# EAGLE design FanControl (EAGLE 7.1.0)
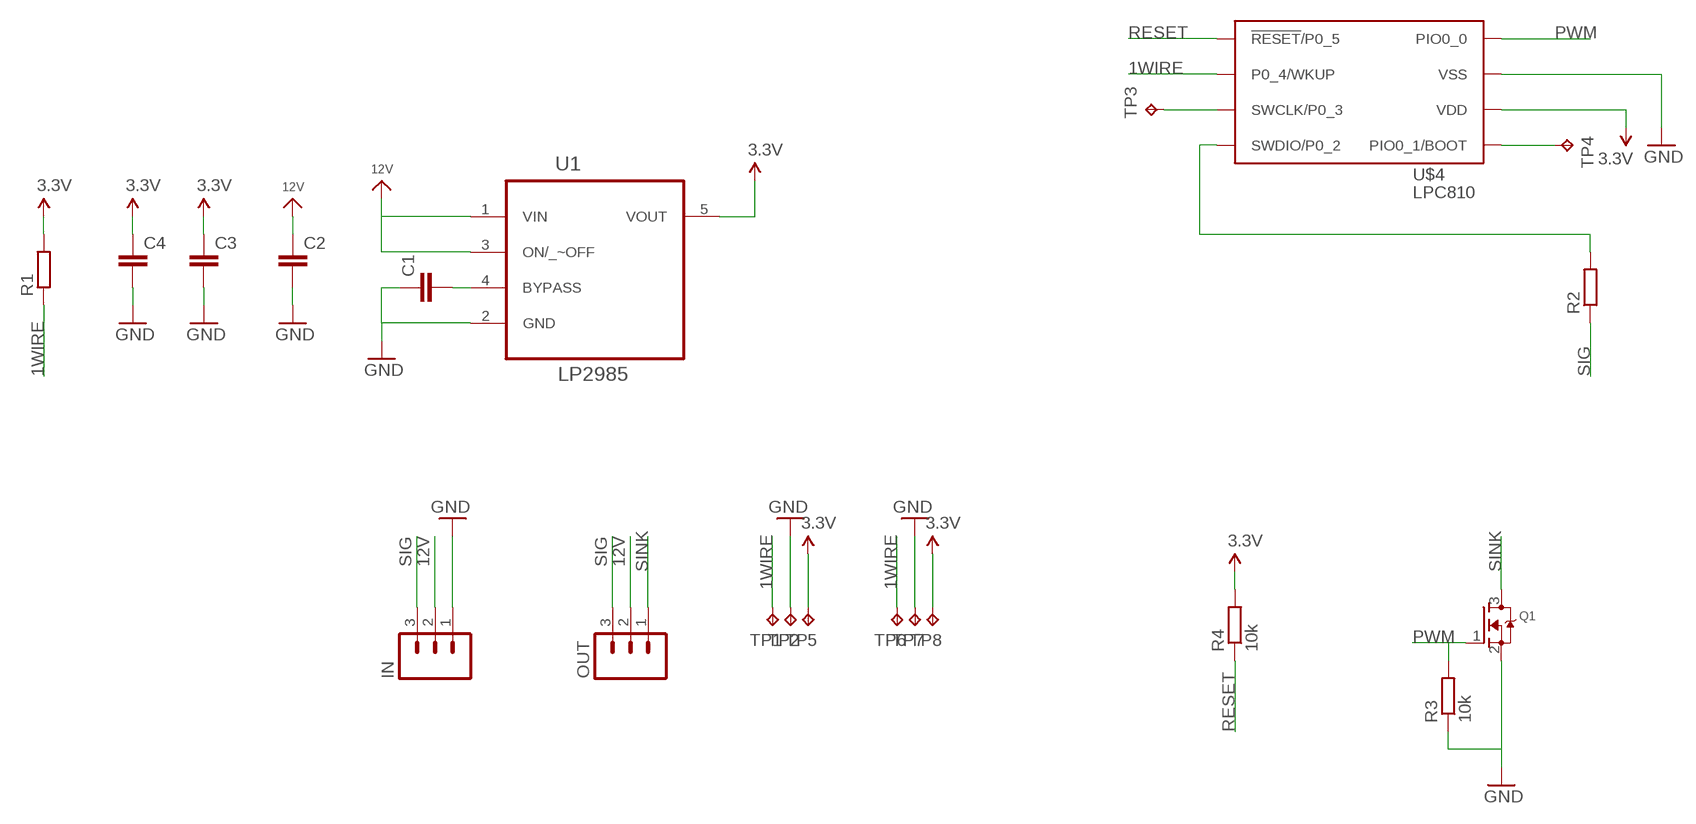
[diagram p0: schematic, sheet 1]

## Parts
C1  C-EUC0603  [C0603]
C2  C-EUC0805  [C0805]
C3  C-EUC0603  [C0603]
C4  C-EUC0805  [C0805]
IN  M03PTH  [1X03]
OUT  M03PTH  [1X03]
Q1  MOSFET-NREFLOW  [SOT23]
R1  R-EU_R0603  [R0603]
R2  R-EU_R0603  [R0603]
R3  10k  R-EU_R0603  [R0603]
R4  10k  R-EU_R0603  [R0603]
TP1  TPB1,27  [B1,27]
TP2  TPB1,27  [B1,27]
TP3  TPB1,27  [B1,27]
TP4  TPB1,27  [B1,27]
TP5  TPB1,27  [B1,27]
TP6  TPB1,27  [B1,27]
TP7  TPB1,27  [B1,27]
TP8  TPB1,27  [B1,27]
U1  LP2985  LP2985-33DBVT  [SOT95P280X145-5N]
U$4  LPC810  LPC810M021FN8  [DIP8]

## Nets
1WIRE: R1.1 TP1.TP TP6.TP U$4.P$2(P0_4/WKUP)
3.3V: C3.1 C4.1 R1.2 R4.2 TP5.TP TP8.TP U1.5(VOUT) U$4.P$6(VDD)
12V: C2.1 IN.2 OUT.2 U1.1(VIN) U1.3(ON/_~OFF)
GND: C1.1 C2.2 C3.2 C4.2 IN.1 Q1.2(S) R3.1 TP2.TP TP7.TP U1.2(GND) U$4.P$7(VSS)
N$1: C1.2 U1.4(BYPASS)
N$2: R2.2 U$4.P$4(SWDIO/P0_2)
N$3: TP3.TP U$4.P$3(SWCLK/P0_3)
N$4: TP4.TP U$4.P$5(PIO0_1/BOOT)
PWM: Q1.1(G) R3.2 U$4.P$8(PIO0_0)
RESET: R4.1 U$4.P$1(!RESET!/P0_5)
SIG: IN.3 OUT.3 R2.1
SINK: OUT.1 Q1.3(D)

## Library data of the parts
C1-C4 = rcl:C-EU: CAPACITOR, European symbol
IN OUT = SparkFun-Connectors:M03: Header 3 Standard 3-pin 0.1" header. Use with straight break away headers (SKU : PRT-00116), right angle break away headers (PRT-00553), swiss pins (PRT-00743), machine pins (PRT-00117), and female headers (PRT-00115). Molex polarized connector foot print use with SKU : PRT-08232 with associated crimp pins and housings.
Q1 = adafruit:MOSFET-N: N-Channel Mosfet 2N7002E - 60V 260mA SOT23 [Digikey: 2N7002ET1GOSTR-ND] - REEL BSH103 - 30V 850mA SOT23 [Digikey: 568-5013-1-ND]
R1-R4 = rcl:R-EU_: RESISTOR, European symbol
TP1-TP8 = testpad:TP: Test pad
U1 = farnell:LP2985-33DBVT: 150-mA LOW-NOISE LOW-DROPOUT REGULATOR WITH SHUTDOWN; MPN: LP2985-33DBVT; OC_FARNELL: -; OC_NEWARK: 43J9347; PACKAGE: SOT-23-5; SUPPLIER: Texas Instruments
U$4 = carrilib:LPC810

## Board
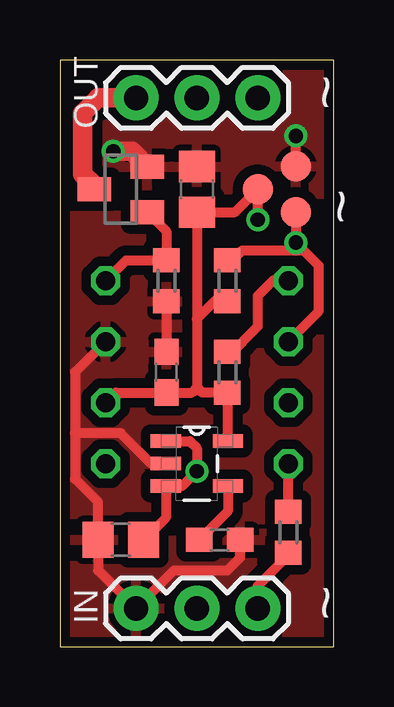
[diagram p1: board, top side]
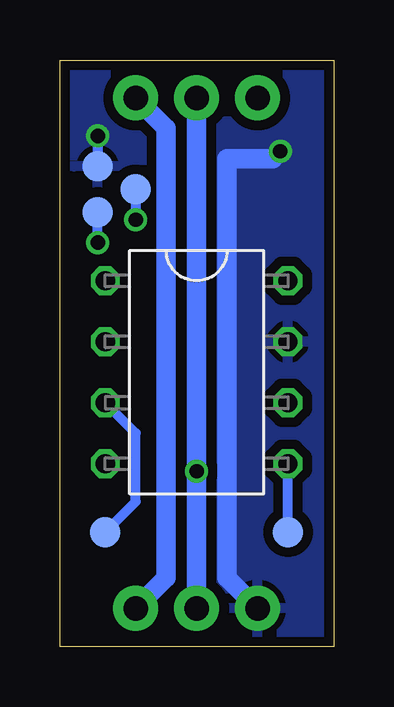
[diagram p2: board, bottom side, seen from below]

Size 11.42 x 24.44 mm. Coordinates in mm from the lower left corner, seen from the top.
Outline: 0,0 11.42,0 11.42,24.44 0,24.44 0,0
Copper layers (1*16): Top 0.0356mm / dielectric 1.5011mm / Bottom 0.0356mm
Design rules "LaenPCBOrder": minimum track width 6mil, minimum drill 13mil, track to track 6mil, track to pad 6mil, pad to pad 6mil, via to via 6mil, smd to smd 6mil, copper to edge 15mil, drill to drill 6mil, minimum pad ring 7mil, minimum via ring 7mil, stop-mask expansion 4mil, vias tented up to drill 0mil, thermal gap 10mil

### Footprints (pad centres in the part's own frame; a part is rotated, then mirrored left to right if it is on the bottom)
C0603 = smd 1.1 x 1: 1 -0.85,0; 2 0.85,0
C0805 = smd 1.3 x 1.5: 1 -0.95,0; 2 0.95,0
1X03 = drill 1.016 pad 1.88: 1 0,0; 2 2.54,0; 3 5.08,0
SOT23 = smd 1 x 1.4: 1 -0.95,-1.1; 2 0.95,-1.1; 3 0,1.1
R0603 = smd 1 x 1.1: 1 -0.85,0; 2 0.85,0
B1,27 = smd 1.27 x 1.27: TP 0,0
SOT95P280X145-5N = smd 1.27 x 0.559: 1 -1.295,0.94; 2 -1.295,0; 3 -1.295,-0.94; 4 1.295,-0.94; 5 1.295,0.94
DIP8 = drill 0.8 octagon: P$1 -3.81,3.81; P$2 -3.81,1.27; P$3 -3.81,-1.27; P$4 -3.81,-3.81; P$5 3.81,-3.81; P$6 3.81,-1.27; P$7 3.81,1.27; P$8 3.81,3.81

### Placement (x,y rotation side)
C1  6.67,4.45 180 top
C2  2.54,4.45 180 top
C3  4.45,11.43 90 top
C4  5.71,19.05 90 top
IN  3.17,1.59 0 top
OUT  3.17,22.86 0 top
Q1  2.54,19.05 90 top
R1  6.99,15.24 270 top
R2  9.53,4.76 90 top
R3  4.45,15.24 90 top
R4  6.99,11.43 270 top
TP1  9.84,18.1 0 top
TP2  9.84,20 90 top
TP3  9.53,4.76 0 bottom
TP4  1.91,4.76 0 bottom
TP5  8.26,19.05 0 top
TP6  9.84,18.1 0 bottom
TP7  9.84,20 0 bottom
TP8  8.26,19.05 0 bottom
U1  5.71,7.62 0 top
U$4  5.71,11.43 0 bottom

### Tracks (layer width: path | path; a pad name or v marks a point on that pad's centre or on a via)
1WIRE  (via drill 0.6)
  Top 0.406: 7.62,16.51 7.61,16.51 R1.1 7,15.89 7.62,16.51 | 7.62,16.51 9.84,16.51 | 9.84,16.51 10.16,16.51 10.79,15.88 10.79,13.97 U$4.P$2 | TP6.TP v9.84,16.83 9.84,16.51
  Bottom 0.406: v9.84,16.83 TP6.TP
3.3V  (via drill 0.6)
  Top 0.406: U1.5 7.01,10.76 R4.2 5.93,10.58 5.71,10.79 | 5.71,13.65 C4.1 7.3,18.1 TP8.TP v8.26,17.78 | 5.71,13.65 5.71,10.79 | U$4.P$6 2.33,10.58 C3.1 5.5,10.58 5.71,10.79 | R1.2 6.45,14.39 5.71,13.65
  Bottom 0.406: TP8.TP v8.26,17.78
12V  (via drill 0.6)
  Top 0.406: U1.1 5.41,8.56 5.71,8.26 v5.71,7.3 5.09,6.68 U1.3 4.42,5.38 C2.1
  Bottom 0.813: OUT.2 v5.71,7.3 IN.2
GND  (via drill 0.6)
  Top 0.406: U1.2 3.81,7.62 2.54,8.89 0.64,8.89 | U$4.P$7 0.64,11.43 0.64,8.89 | Q1.2 4.13,20 | R3.1 C3.2 | C4.2 6.01,20 | 4.12,20 3.81,19.68 | C1.1 7.52,3.71 6.99,3.17 4.76,3.17 IN.1 1.59,3.17 C2.2 1.59,6.03 0.64,6.99 0.64,8.89 | TP7.TP v9.84,21.27
  Top 0.813: v2.22,20.64 3,20.64 Q1.2
  Bottom 0.406: v9.84,21.27 TP7.TP
  Bottom 0.813: IN.1 4.45,2.86 4.45,20.32 2.54,20.32 v2.22,20.64
  pour Top (isolate 0.406): 0,24.45 11.43,24.45 11.43,0 0,0
  pour Bottom (isolate 0.406): 0,24.45 11.43,24.45 11.43,0 0,0
N$1
  Top 0.406: U1.4 7.01,5.64 C1.2
N$2
  Top 0.406: R2.2 U$4.P$4
N$3
  Bottom 0.406: U$4.P$3 8.26,8.89 8.26,6.03 TP3.TP
N$4
  Bottom 0.406: TP4.TP U$4.P$5
PWM
  Top 0.406: U$4.P$8 2.75,16.09 R3.2 4.45,17.3 Q1.1
RESET
  Top 0.406: R4.1 7,12.08 8.26,13.34 8.26,14.61 8.89,15.24 U$4.P$1
SIG
  Top 0.406: IN.3 8.26,2.52 9.32,3.6 R2.1
  Bottom 0.813: IN.3 6.99,2.86 6.99,21.59 OUT.3
SINK
  Top 0.813: Q1.3 1.44,19.2 0.95,19.68 0.95,22.23 1.59,22.86 OUT.1

### Text on the board
tPlace: ~ | OUT | ~ | ~ | IN